# Altium schematic sheet DB_Bypass.SchDoc: Board Bypass Capacitors
size A4; DrawnBy: Brett Muir; SheetNumber: 2; SheetTotal: 20; PageSetup: Record=PageOptions|CenterHorizontal=True|CenterVertical=True|PrintScale=0.97|XCorrection=1.00|YCorrection=1.00|PrintKind=0|BorderSize=5000000|LeftOffset=0|BottomOffset=0|Orientation=2|PaperLength=1000|PaperWidth=1000|Scale=100|PaperSource=7|PrintQuality=-4|MediaType=1|DitherType=10|PaperKind=A3 (297 x 420mm)|PrintScaleMode=1
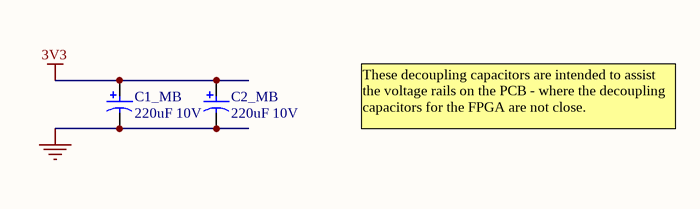
[diagram p0: DB_Bypass.SchDoc]

## Parts
C1_MB  220uF 10V  [CAPC7343-STAR]
C2_MB  220uF 10V  [CAPC7343-STAR]

## Nets
3V3: C1_MB.1 C2_MB.1
GND: C1_MB.2 C2_MB.2

## Notes on the sheet
- These decoupling capacitors are intended to assist the voltage rails on the PCB - where the decoupling capacitors for the FPGA are not close.
- Sheet Title
- Project Title
- Size:
- Date:
- A4
- Assy:
- Time:
- Sheet
- Revision:
- of
- File:

## Library data of the parts
C1_MB C2_MB = D-101-0088: Capacitor, Tantalum, 220uF 10% 10V MCCT-D (7343-31); Polarity: Polarized; Capacitance: 220 uF; Mounting Technology: Surface Mount; Rated Voltage: 10 V; Status: Unreleased; Technology: Tantalum; Tolerance: 10 %; Category: Capacitor